# Altium schematic sheet WT2_Ports.SchDoc
size A4
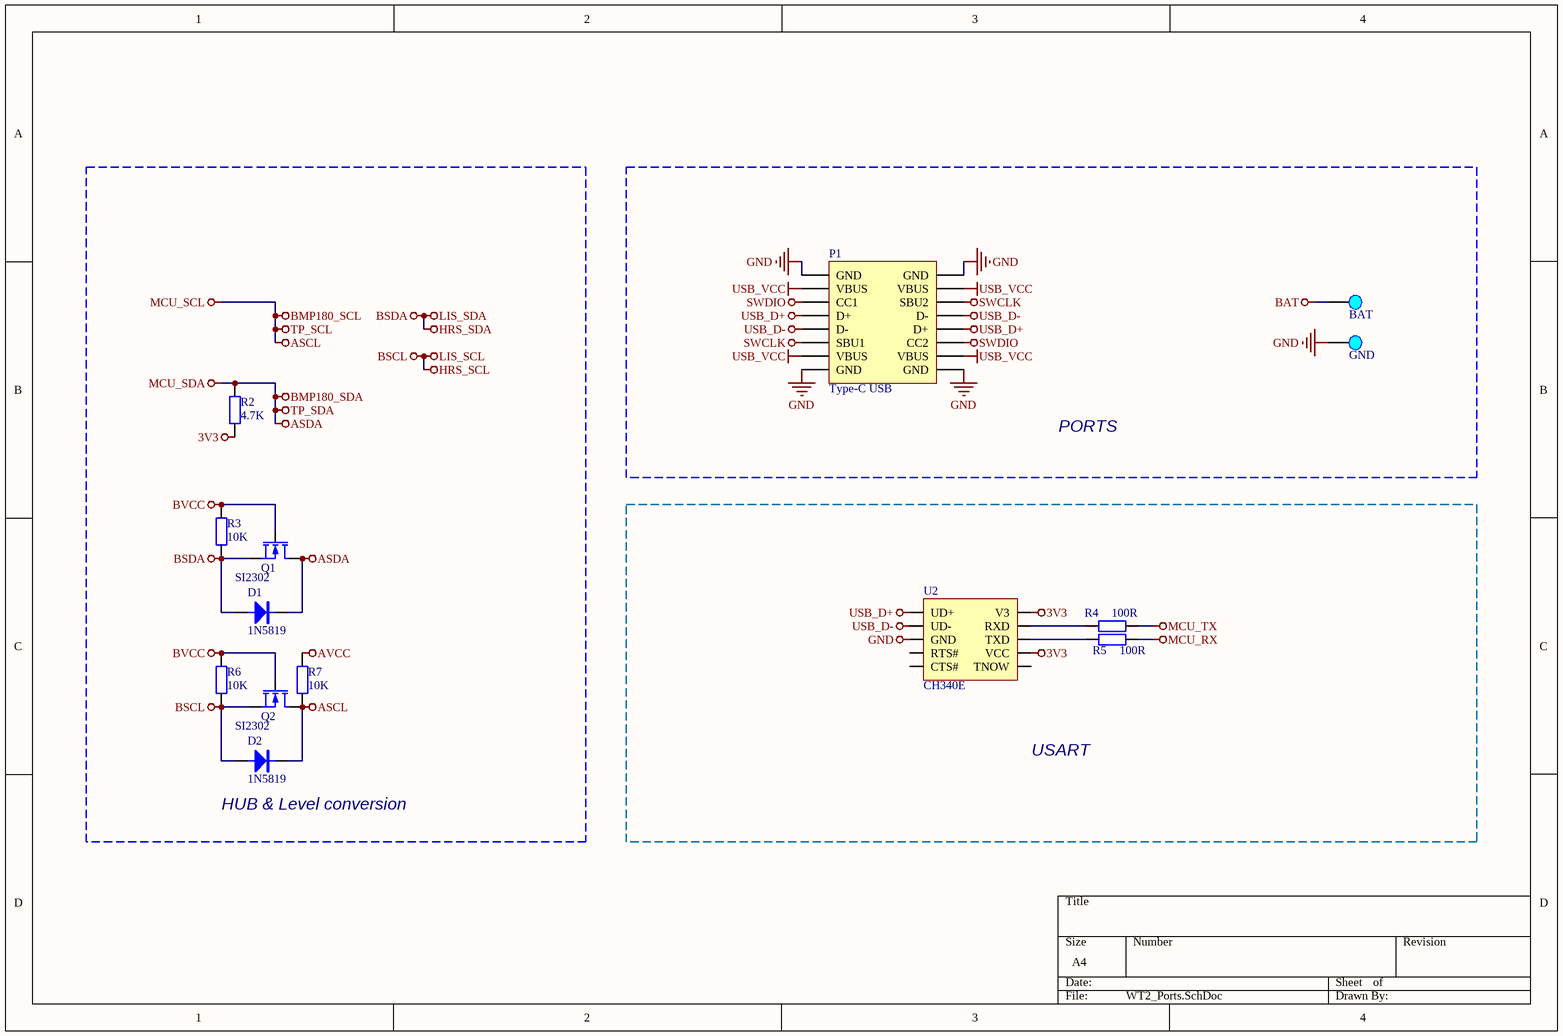
[diagram p0: WT2_Ports.SchDoc]

## Parts
D1  1N5819  [二极管_SOD-323]
D2  1N5819  [二极管_SOD-323]
P1  Type-C USB  [Type-C_16P]
Pad1  BAT  [Pad_A]
Pad2  GND  [Pad_A]
Q1  SI2302  [MOS_SOT-23]
Q2  SI2302  [MOS_SOT-23]
R2  4.7K  [电阻_R0402]
R3  10K  [电阻_R0402]
R4  100R  [电阻_R0402]
R5  100R  [电阻_R0402]
R6  10K  [电阻_R0402]
R7  10K  [电阻_R0402]
U2  CH340E  [MSOP10]

## Blocks framed on the sheet
HUB & Level conversion: D1 D2 Q1 Q2 R2 R3 R6 R7
PORTS: P1 Pad1 Pad2
USART: R4 R5 U2

## Nets
3V3: R2.1 U2.7(VCC) U2.10(V3)
ASCL: D2.K Q2.2(D) R7.2  [also labelled BMP180_SCL, MCU_SCL, TP_SCL]
ASDA: D1.K Q1.2(D) R2.2  [also labelled BMP180_SDA, MCU_SDA, TP_SDA]
AVCC: R7.1
BAT: Pad1.1
BSCL: D2.A Q2.3(S) R6.2  [also labelled HRS_SCL, LIS_SCL]
BSDA: D1.A Q1.3(S) R3.2  [also labelled HRS_SDA, LIS_SDA]
BVCC: Q1.1(G) Q2.1(G) R3.1 R6.1
GND: P1.0(GND) P1.A1(GND) P1.A12(GND) P1.B1(GND) P1.B12(GND) Pad2.1 U2.3(GND)
MCU_RX: R5.1
MCU_TX: R4.1
SWCLK: P1.A8(SBU1) P1.B8(SBU2)
SWDIO: P1.A5(CC1) P1.B5(CC2)
USB_D+: P1.A6(D+) P1.B6(D+) U2.1(UD+)
USB_D-: P1.A7(D-) P1.B7(D-) U2.2(UD-)
USB_VCC: P1.A4(VBUS) P1.A9(VBUS) P1.B4(VBUS) P1.B9(VBUS)
NetR4_2: R4.2 U2.9(RXD)
NetR5_2: R5.2 U2.8(TXD)

Not connected (* = marked no-connect by the designer): U2 4(RTS#) 5(CTS#) 6(TNOW)

## Library data of the parts
D1 D2 = Diode: _Specification: Diode,1N5819,SOD-323,1A,40V; _Comma: ,; _Footprint: SOD-323; _Voltage: 40V; _Current: 1A; _Name: Diode; _Model: 1N5819
P1 = Type-C USB Easy 16PIN: _Comma: ,; _Name: Port; _Specification: Port,Type-C USB,16PIN; _Value: 16PIN; _Model: Type-C USB
Pad1 = Pad: _Funcyusa: Test; _Specification: Pad,Test,BAT; _Comma: ,; _Name: Pad; _Remarks: BAT
Pad2 = Pad: _Funcyusa: Test; _Specification: Pad,Test,GND; _Comma: ,; _Name: Pad; _Remarks: GND
Q1 Q2 = MOSFET-N: _Comma: ,; _Current: 150A; _Footprint: DFN5*6; _Name: N-MOSFET; _Specification: N-MOSFET,SI2302,DFN5*6,150A,30V; _Voltage: 30V; _Model: SI2302
R2-R7 = Res: P: 1/8W; 参数: Res,0805,0R,±1%,1/8W,100ppm,155C
  R2: R: 4.7K
  R3 R6 R7: R: 10K
  R4 R5: R: 100R